# Altium project Upper board.PrjPcb
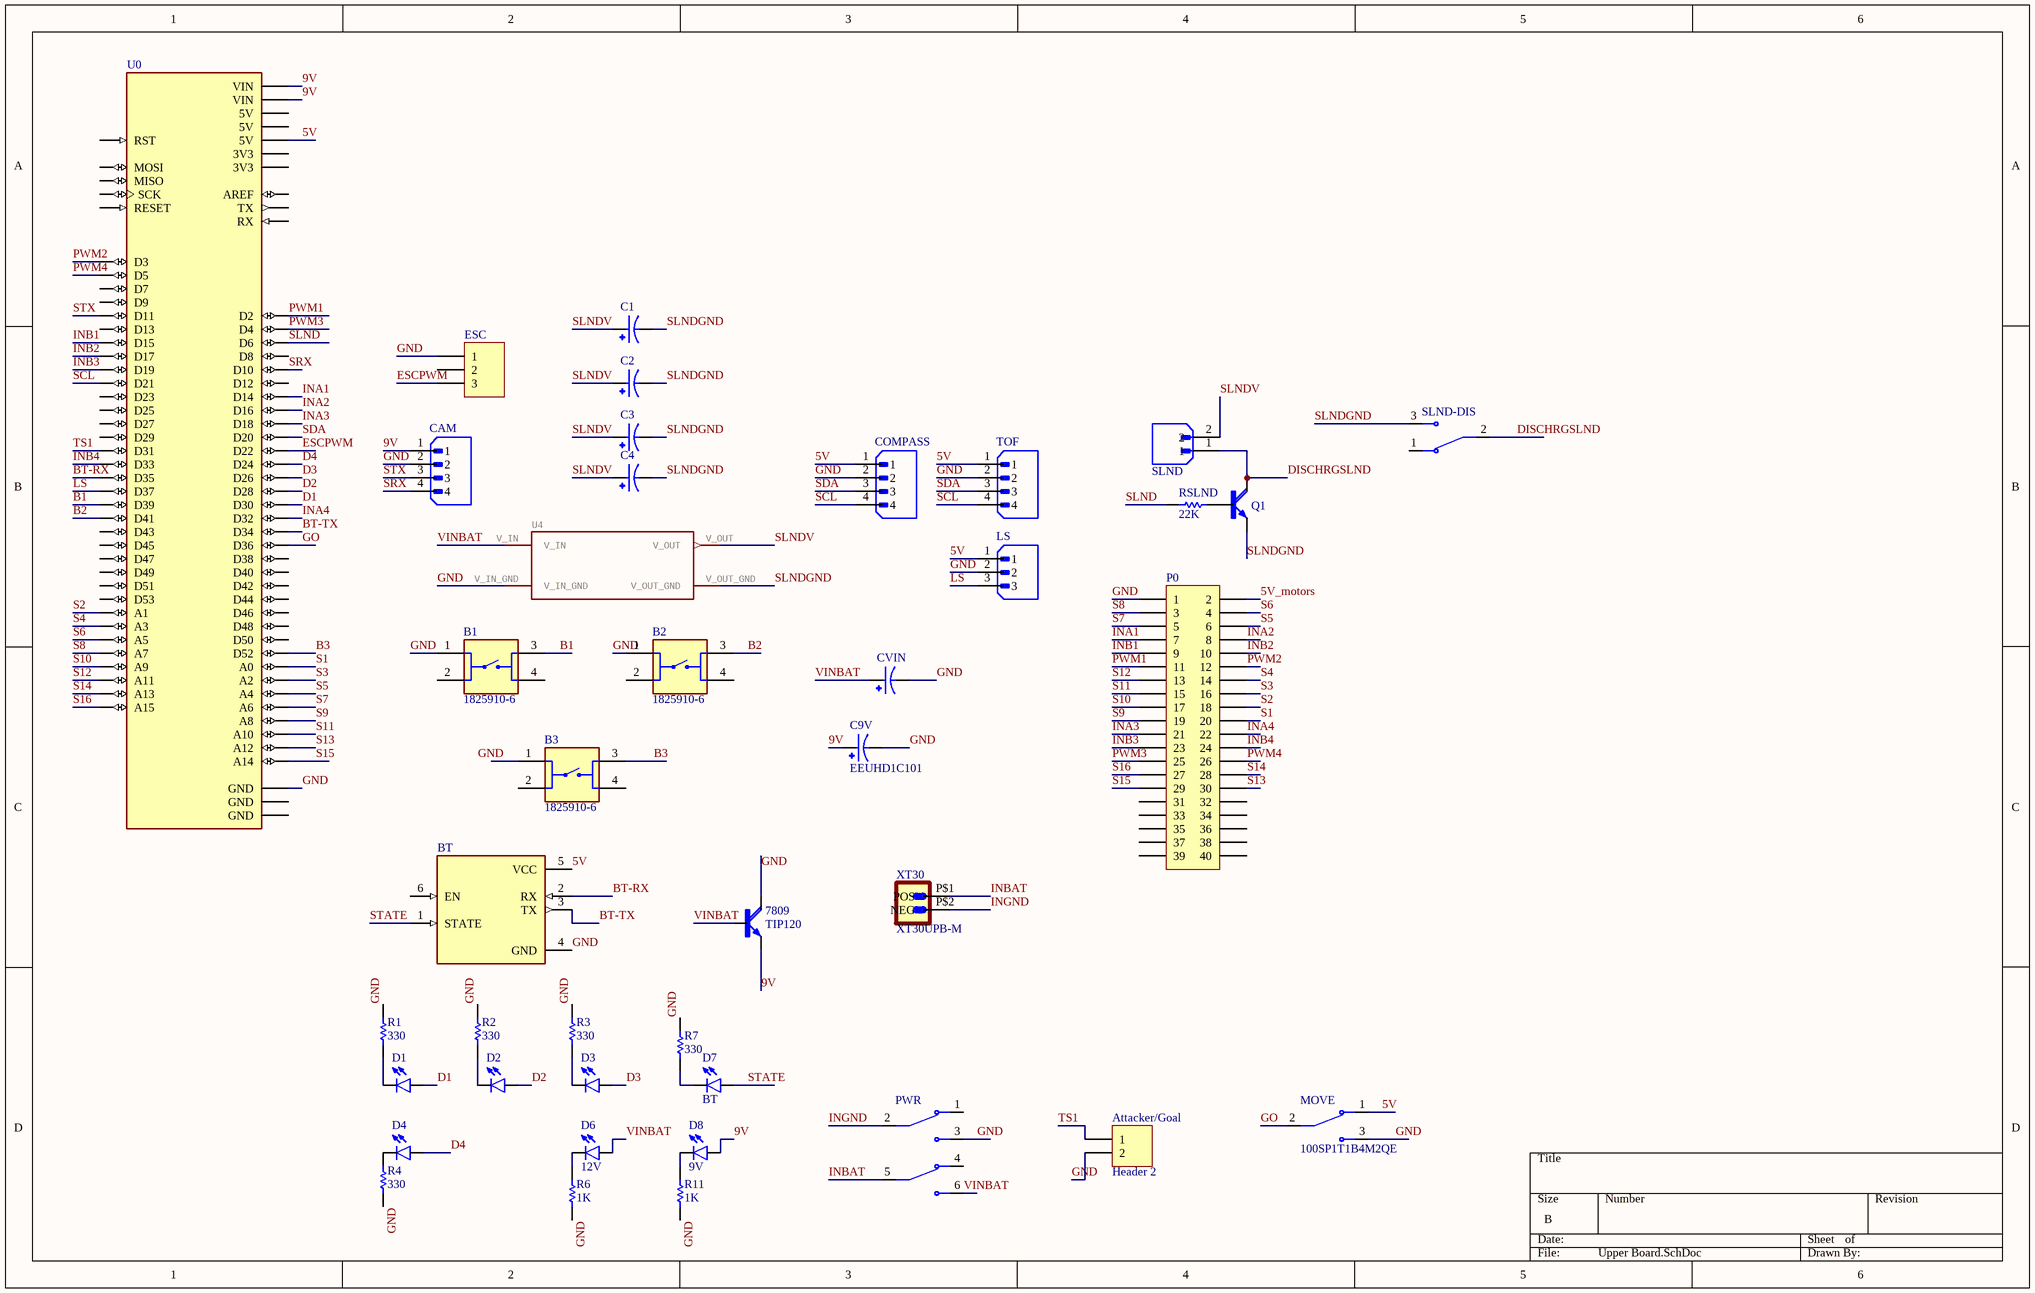
[diagram p0: Upper Board.SchDoc]
1 sheet, 41 parts. Net scope: global (net labels, ports and power ports of the same name join across sheets).
Board file: Upper Board.PcbDoc

## Sheet Upper Board.SchDoc
size B; SheetNumber: 1; SheetTotal: 1

### Parts
7809  TIP120  [TO220AH]
Attacker/Goal  Header 2  [HDR1X2]
B1  1825910-6  [SW_1825910-6-4]
B2  1825910-6  [SW_1825910-6-4]
B3  1825910-6  [SW_1825910-6-4]
BT  ZC142200  [MODULE_ZC142200]  (value not drawn)
C1  EEUHD1H222  [CAPPRD750W80D1600H3150]  (value not drawn)
C2  EEUHD1H222  [CAPPRD750W80D1600H3150]  (value not drawn)
C3  EEUHD1H222  [CAPPRD750W80D1600H3150]  (value not drawn)
C4  EEUHD1H222  [CAPPRD750W80D1600H3150]  (value not drawn)
C9V  EEUHD1C101  [CAPPRD250W50D500H1100]
CAM  B4B-XH-A(LF)(SN)  [JST_B4B-XH-A(LF)(SN)]  (value not drawn)
COMPASS  B4B-XH-A(LF)(SN)  [JST_B4B-XH-A(LF)(SN)]  (value not drawn)
CVIN  EEUFR1C102B  [CAPPRD500W60D1000H1600]  (value not drawn)
D1  TLLG4400  [LED3MM]  (value not drawn)
D2  TLLG4400  [LED3MM]  (value not drawn)
D3  TLLG4400  [LED3MM]  (value not drawn)
D4  TLLG4400  [LED3MM]  (value not drawn)
D6  12V  [LED3MM]
D7  BT  [LED3MM]
D8  9V  [LED3MM]
ESC  Header 3  [HDR1X3]  (value not drawn)
LS  B3B-XH-A(LF)(SN)  [JST_B3B-XH-A(LF)(SN)]  (value not drawn)
MOVE  100SP1T1B4M2QE  [3_pin_toggle_switch]
P0  Header 20X2  [HDR2X20]  (value not drawn)
PWR  100DP1T1B1M2QEH  [SW_100DP1T1B1M2QEH]  (value not drawn)
Q1  TIP120  [TO220AH]  (value not drawn)
R1  330  [AXIAL-0.3]
R2  330  [AXIAL-0.3]
R3  330  [AXIAL-0.3]
R4  330  [AXIAL-0.3]
R6  1K  [AXIAL-0.3]
R7  330  [AXIAL-0.3]
R11  1K  [AXIAL-0.3]
RSLND  22K  [AXIAL-0.3]
SLND  B2B-XH-A(LF)(SN)  [JST_B2B-XH-A(LF)(SN)]  (value not drawn)
SLND-DIS  100SP1T1B4M2QE  [3_pin_toggle_switch]  (value not drawn)
TOF  B4B-XH-A(LF)(SN)  [JST_B4B-XH-A(LF)(SN)]  (value not drawn)
U0  MEGA_PRO_EMBED_CH340G_/_ATMEGA2560  [MODULE_MEGA_PRO_EMBED_CH340G_/_ATMEGA2560]  (value not drawn)
U4  XL6009 Boost converter   Vin: 3-35V, 4A Vout: 5-35V, 2A Quiescent current: 18mA Switching frequency: 400KHz Ripple: 50mV Voltage regulation: 0.5% Size: 43 x 22 x 16mm  [XL6009_BOOST_MODULE]  (value not drawn)
XT30  XT30UPB-M  [XT30UPB-M]

### Nets
5V: BT.5(VCC) COMPASS.1 LS.1 MOVE.1 TOF.1 U0.5V_3(5V)
5V_motors: P0.2
9V: 7809.E C9V.P CAM.1 D8.A U0.VIN_1(VIN) U0.VIN_2(VIN)
B1: B1.3 U0.D39
B2: B2.3 U0.D41
B3: B3.3 U0.D52
BT-RX: BT.2(RX) U0.D35
BT-TX: BT.3(TX) U0.D34
D1: D1.A U0.D30
D2: D2.A U0.D28
D3: D3.A U0.D26
D4: D4.A U0.D24
DISCHRGSLND: Q1.C SLND.1 SLND-DIS.2
ESCPWM: ESC.3 U0.D22
GND: 7809.C Attacker/Goal.2 B1.1 B2.1 B3.1 BT.4(GND) C9V.N CAM.2 COMPASS.2 CVIN.N ESC.1 LS.2 MOVE.3 P0.1 PWR.3 R1.2 R2.2 R3.2 R4.2 R6.2 R7.2 R11.2 TOF.2 U0.GND_1(GND) U4.V_IN_GND
GO: MOVE.2 U0.D36
INA1: P0.7 U0.D14
INA2: P0.8 U0.D16
INA3: P0.21 U0.D18
INA4: P0.22 U0.D32
INB1: P0.9 U0.D15
INB2: P0.10 U0.D17
INB3: P0.23 U0.D19
INB4: P0.24 U0.D33
INBAT: PWR.5 XT30.P$1(POS)
INGND: PWR.2 XT30.P$2(NEG)
LS: LS.3 U0.D37
PWM1: P0.11 U0.D2
PWM2: P0.12 U0.D3
PWM3: P0.25 U0.D4
PWM4: P0.26 U0.D5
S1: P0.20 U0.A0
S2: P0.18 U0.A1
S3: P0.16 U0.A2
S4: P0.14 U0.A3
S5: P0.6 U0.A4
S6: P0.4 U0.A5
S7: P0.5 U0.A6
S8: P0.3 U0.A7
S9: P0.19 U0.A8
S10: P0.17 U0.A9
S11: P0.15 U0.A10
S12: P0.13 U0.A11
S13: P0.30 U0.A12
S14: P0.28 U0.A13
S15: P0.29 U0.A14
S16: P0.27 U0.A15
SCL: COMPASS.4 TOF.4 U0.D21
SDA: COMPASS.3 TOF.3 U0.D20
SLND: RSLND.1 U0.D6
SLNDGND: C1.N C2.N C3.N C4.N Q1.E SLND-DIS.3 U4.V_OUT_GND
SLNDV: C1.P C2.P C3.P C4.P SLND.2 U4.V_OUT
SRX: CAM.4 U0.D10
STATE: BT.1(STATE) D7.A
STX: CAM.3 U0.D11
TS1: Attacker/Goal.1 U0.D31
VINBAT: 7809.B CVIN.P D6.A PWR.6 U4.V_IN
NetD1_K: D1.K(C) R1.1
NetD2_K: D2.K(C) R2.1
NetD3_K: D3.K(C) R3.1
NetD4_K: D4.K(C) R4.1
NetD6_K: D6.K(C) R6.1
NetD7_K: D7.K(C) R7.1
NetD8_K: D8.K(C) R11.1
NetQ1_B: Q1.B RSLND.2

Not connected (* = marked no-connect by the designer): B1 2 4; B2 2 4; B3 2 4; BT 6(EN); ESC 2; P0 31 32 33 34 35 36 37 38 39 40; PWR 1 4; SLND-DIS 1; U0 3V3_1(3V3) 3V3_2(3V3) 5V_1(5V) 5V_2(5V) AREF D7 D8 D9 D12 D13 D23 D25 D27 D29 D38 D40 D42 D43 D44 D45 D46 D47 D48 D49 D50 D51 D53 GND_2(GND) GND_3(GND) MISO MOSI RESET RST RX SCK TX

### Library data of the parts
7809 Q1 = TIP120: Bipolar _BJT_ Transistor NPN - Darlington 60V 5A 2W Through Hole TO-220-3; MF: ON Semiconductor; Value: *; SnapEDA_Link: https://www.snapeda.com/parts/TIP120/ON%20Semiconductor/view-part/2842527/?ref=snap; MP: TIP120; Availability: Unavailable; Price: None; Package: TO-220-3 Bourns
Attacker/Goal = Header 2: Header, 2-Pin; LatestRevisionDate: 17-Jul-2002; LatestRevisionNote: Re-released for DXP Platform.; Publisher: Altium Limited
B1-B3 = 1825910-6: Switch Push Button OFF (ON) SPST Round Button 0.05A 24VDC Momentary Contact PC Pins Thru-Hole; MF: TE Connectivity; Value: *; MP: 1825910-6; Package: None; Check_prices: https://www.snapeda.com/parts/1825910-6/TE+Connectivity+ALCOSWITCH+Switches/view-part/?ref=eda; SnapEDA_Link: https://www.snapeda.com/parts/1825910-6/TE+Connectivity+ALCOSWITCH+Switches/view-part/?ref=snap; Digi-Key_Part_Number: 450-1650-ND; Purchase-URL: https://pricing.snapeda.com/search/part/1825910-6/?ref=eda
BT = ZC142200: 1pc HC-05 6 Pin Wireless Bluetooth RF Transceiver Module Serial For Arduino; Price: None; MP: ZC142200; Availability: Unavailable; Value: *; Package: None
C1-C4 = EEUHD1H222: 2200ÂµF 50V Aluminum Electrolytic Capacitors Radial, Can 2000 Hrs @ 105Â°C; MF: Panasonic; Check_prices: https://www.snapeda.com/parts/EEUHD1H222/Panasonic/view-part/5790753/?ref=eda; Value: *; Availability: In Stock; Price: None; SnapEDA_Link: https://www.snapeda.com/parts/EEUHD1H222/Panasonic/view-part/5790753/?ref=snap; Package: RADIAL-2 Panasonic; MP: EEUHD1H222
C9V = EEUHD1C101: CAP ALUM 100UF 20% 16V RADIAL; MF: Panasonic; Availability: In Stock; Check_prices: https://www.snapeda.com/parts/EEUHD1C101/Panasonic/view-part/5791153/?ref=eda; SnapEDA_Link: https://www.snapeda.com/parts/EEUHD1C101/Panasonic/view-part/5791153/?ref=snap; Package: RADIAL-2 Panasonic; MP: EEUHD1C101; Value: *; Price: None
CAM COMPASS TOF = B4B-XH-A(LF)(SN): Connector Header Through Hole 4 position 0.098 (2.50mm); MF: JST Sales; SnapEDA_Link: https://www.snapeda.com/parts/B4B-XH-A(LF)(SN)/JST+Sales+America+Inc./view-part/?ref=snap; Package: None; Value: *; MP: B4B-XH-A(LF)(SN); Check_prices: https://www.snapeda.com/parts/B4B-XH-A(LF)(SN)/JST+Sales+America+Inc./view-part/?ref=eda
CVIN = EEUFR1C102B: CAP ALUM 1000UF 20% 16V RADIAL; MF: Panasonic; MP: EEU-FR1C102B; Value: *; Price: None; Package: RADIAL-2 Panasonic; SnapEDA_Link: https://www.snapeda.com/parts/EEU-FR1C102B/Panasonic/view-part/2318035/?ref=snap; Check_prices: https://www.snapeda.com/parts/EEU-FR1C102B/Panasonic/view-part/2318035/?ref=eda; Availability: In Stock; Purchase-URL: https://pricing.snapeda.com/search/part/EEU-FR1C102B/?ref=eda
D1-D4 D6-D8 = TLLG4400: Green 569nm LED Indication - Discrete 1.9V Radial; MF: Vishay Semiconductors; MP: TLLG4400; SnapEDA_Link: https://www.snapeda.com/parts/TLLG4400/Vishay/view-part/?ref=snap; Availability: In Stock; Package: None; Check_prices: https://www.snapeda.com/parts/TLLG4400/Vishay/view-part/?ref=eda; Value: *; Purchase-URL: https://pricing.snapeda.com/search/part/TLLG4400/?ref=eda; Price: None
ESC = Header 3: Header, 3-Pin; LatestRevisionDate: 17-Jul-2002; LatestRevisionNote: Re-released for DXP Platform.; Publisher: Altium Limited
LS = B3B-XH-A(LF)(SN): Connector Header Through Hole 3 position 0.098 (2.50mm); MF: JST Sales; SnapEDA_Link: https://www.snapeda.com/parts/B3B-XH-A(LF)(SN)/JST+Sales+America+Inc./view-part/?ref=snap; Package: None; Value: *; MP: B3B-XH-A(LF)(SN); Check_prices: https://www.snapeda.com/parts/B3B-XH-A(LF)(SN)/JST+Sales+America+Inc./view-part/?ref=eda
MOVE SLND-DIS = 100SP1T1B4M2QE: Toggle Switch SPDT Through Hole; Package: None; Price: None; Value: *; MP: 100SP1T1B4M2QE; Availability: Unavailable
P0 = Header 20X2: Header, 20-Pin, Dual row; LatestRevisionDate: 17-Jul-2002; LatestRevisionNote: Re-released for DXP Platform.; Publisher: Altium Limited
R1-R4 R6 R7 R11 RSLND = Res1: Resistor; Published: 8-Jun-2000; LatestRevisionDate: 17-Jul-2002; LatestRevisionNote: Re-released for DXP Platform.; PackageReference: AXIAL-0.3; Publisher: Altium Limited; PackageDescription: Axial Device, Thru-Hole; 2 Leads; 0.3 in Pin Spacing
SLND = B2B-XH-A(LF)(SN): Connector Header Through Hole 2 position 0.098 (2.50mm); MF: JST Sales; SnapEDA_Link: https://www.snapeda.com/parts/B2B-XH-A(LF)(SN)/JST+Sales+America+Inc./view-part/?ref=snap; Package: None; Value: *; MP: B2B-XH-A(LF)(SN); Check_prices: https://www.snapeda.com/parts/B2B-XH-A(LF)(SN)/JST+Sales+America+Inc./view-part/?ref=eda
U0 = MEGA_PRO_EMBED_CH340G_/_ATMEGA2560: Mega 2560 PRO (Embed) CH340G/ATmega2560-16AU; Price: None; Value: *; MP: MEGA_PRO_EMBED_CH340G_/_ATMEGA2560; Package: None; Availability: Unavailable
U4 = XL6009_BOOST_MODULE: GateName_1: G$1; SymbolName_1: XL6009_BOOST_MODULE; LibraryName: breakout-modules; DeviceSetName: XL6009_BOOST_MODULE; Package: XL6009_BOOST_MODULE
XT30 = XT30UPB-M: Socket; DC supply; XT30; male; PIN: 2; on PCBs; THT; yellow; 15A; 500V; MF: amass; MP: XT30UPB-M; Value: *; SnapEDA_Link: https://www.snapeda.com/parts/XT30UPB-M/AMASS/view-part/?ref=snap; Price: None; Package: None; Check_prices: https://www.snapeda.com/parts/XT30UPB-M/AMASS/view-part/?ref=eda; Availability: Not in stock
PWR = 100DP1T1B1M2QEH: MP: 100DP1T1B1M2QEH; Availability: Unavailable; Package: None; Price: None; Value: *